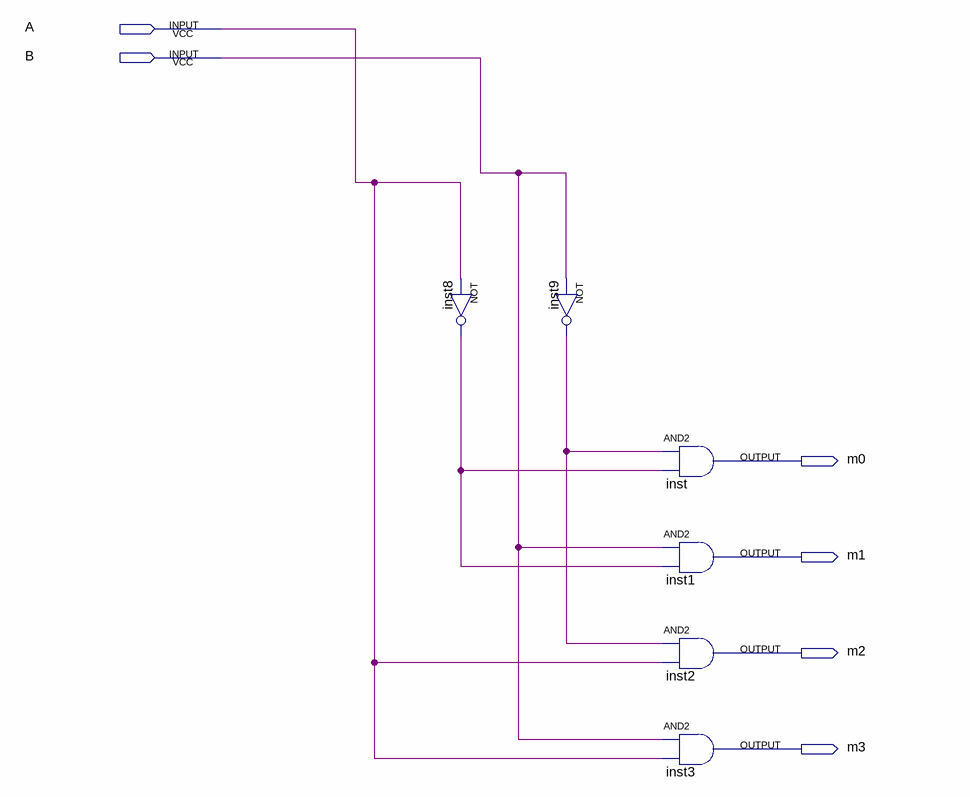
[diagram p0: schematic sheet]
// Quartus schematic 2to4Decoder_2Inputs.bdf as structural Verilog: 6 symbols, 6 pins
module \2to4Decoder_2Inputs  (
  input  A,
  input  B,
  output m0,
  output m1,
  output m2,
  output m3
);

  wire inst8_out, inst9_out;

  not inst8 (inst8_out, A);
  not inst9 (inst9_out, B);
  and inst (m0, inst9_out, inst8_out);
  and inst1 (m1, B, inst8_out);
  and inst2 (m2, inst9_out, A);
  and inst3 (m3, B, A);
endmodule
